# Altium schematic sheet MAX680_10V_Converter.SchDoc
size A
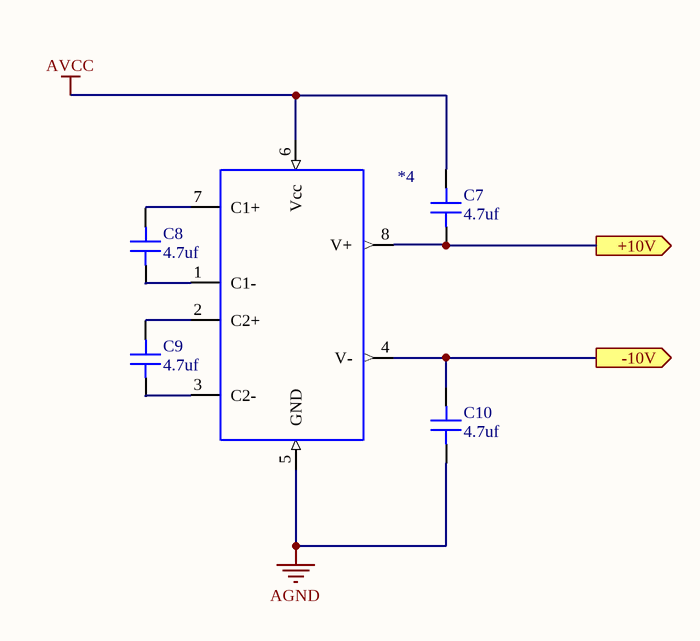
[diagram p0: MAX680_10V_Converter.SchDoc]

## Parts
*4  Null  [SOIC-8]  (value not drawn)
C7  value 4.7uf  [CAP 0805/2012]  (hidden comment: Capacitor MLCC 4.7uf 16V CAP 0805/2012)
C8  value 4.7uf  [CAP 0805/2012]  (hidden comment: Capacitor MLCC 4.7uf 16V CAP 0805/2012)
C9  value 4.7uf  [CAP 0805/2012]  (hidden comment: Capacitor MLCC 4.7uf 16V CAP 0805/2012)
C10  value 4.7uf  [CAP 0805/2012]  (hidden comment: Capacitor MLCC 4.7uf 16V CAP 0805/2012)

## Ports
+10V (out), -10V (out)

## Nets
AGND: *4.5(GND) C10.1
AVCC: *4.6(Vcc) C7.2
+10V: *4.8(V+) C7.1 ; port +10V
-10V: *4.4(V-) C10.2 ; port -10V
Net*4_1: *4.1(C1-) C8.1
Net*4_2: *4.2(C2+) C9.2
Net*4_3: *4.3(C2-) C9.1
Net*4_7: *4.7(C1+) C8.2

## Library data of the parts
*4 = 14: IC REG SWTCHD CAP INV 10MA 8SOIC; Manufacturer_id: 1; idPMIC_Lin: 14; Name: MAX680CSA; Value: 10V; Output_Config: Fixed; Num_Outputs: 2; Vin(Min): 2V; Vin(Max): 6V; Vout(Min): +2Vin; Created_By: Albert Panuco; Drawer_id: 1; Power: Null; Vout(Max): 10V; Vout_Type: Null; Current_Rating: 10mA; Dropout_Voltage: Null; Package: SOIC-8; MfrPartNo: MAX680CSA; Link: https://www.digikey.com/product-detail/en/maxim-integrated/MAX680CSA/MAX680CSA-ND/142563; ComponentLink1Description: Null; ComponentLink1URL: Null; Supplier1: Null; Supplier1PartNo: Null; Updated_By: Null
C7-C10 = 353: Manufacturer_id: 1; idCapacitor: 353; Name: Cap_4.7uf_16V_CAP 0805/2012; Dielectric: Ceramic; Created_By: Nick Mah; Drawer_id: 1; Voltage_Rating: 16V; Package: CAP 0805/2012; Created_Date: 10/20/2018